# Altium schematic sheet VTG-Ctrl.SchDoc
size A4; Author: Auth. Name; CompanyName: Audi Formula Racing GmbH; Organization: Audi Formula Racing GmbH; Address1: Heinrichsheimstr. 200; Address2: D-86633 Neuburg a.d. Donau; SheetNumber: 1; SheetTotal: 14
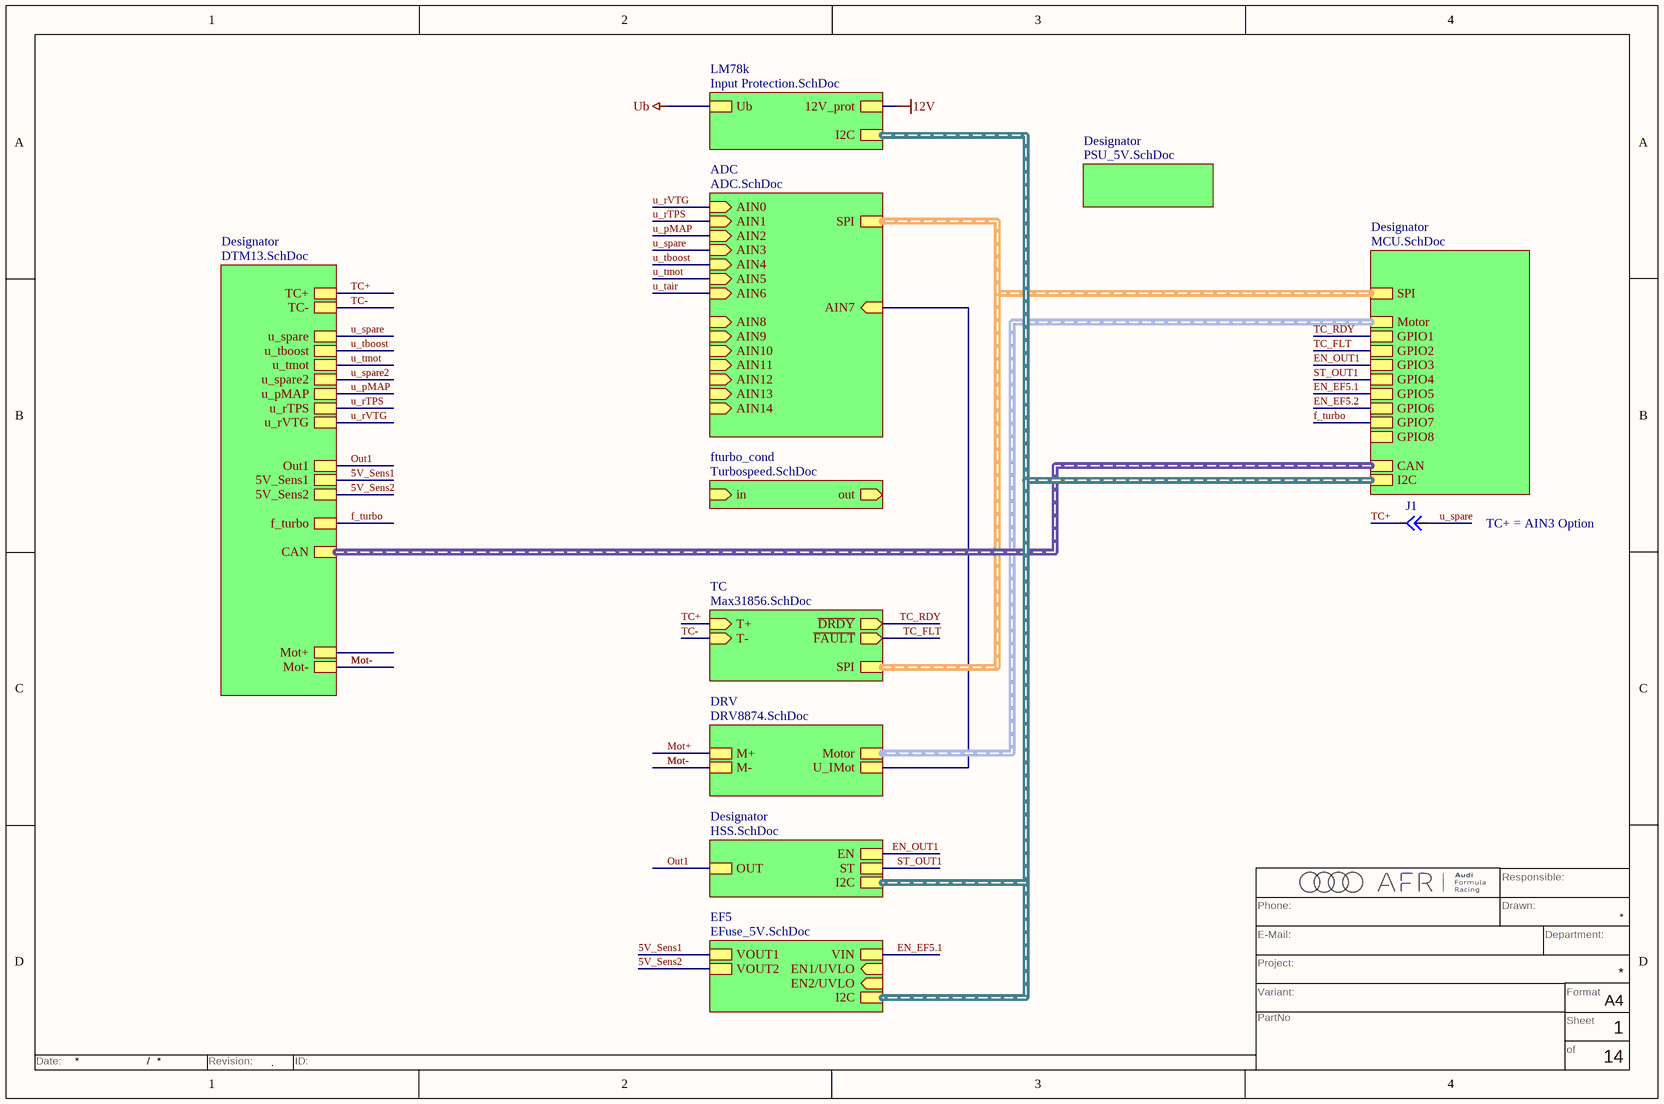
[diagram p0: VTG-Ctrl.SchDoc]

## Parts
J1  JUMPER  [JUMPER]  (value not drawn)

## Sub-sheets
ADC = ADC.SchDoc: AIN0 (in), AIN1 (in), AIN2 (in), AIN3 (in), AIN4 (in), AIN5 (in), AIN6 (in), AIN7 (in), SPI (harness SPI), AIN8 (in), AIN9 (in), AIN10 (in), AIN11 (in), AIN12 (in), AIN13 (in), AIN14 (in)
Designator = MCU.SchDoc: SPI (harness SPI), Motor (harness MotCtrl), GPIO1, GPIO2, GPIO3, GPIO4, GPIO5, CAN (harness CAN), GPIO6, GPIO7, GPIO8, I2C (harness I2C)
Designator = PSU_5V.SchDoc: no entries
Designator = HSS.SchDoc: ST, EN, OUT, I2C (harness I2C)
Designator = DTM13.SchDoc: TC+, TC-, u_spare, u_tboost, u_tmot, u_spare2, Out1, u_pMAP, u_rTPS, 5V_Sens1, 5V_Sens2, f_turbo, u_rVTG, Mot+, Mot-, CAN (harness CAN)
DRV = DRV8874.SchDoc: Motor (harness MotCtrl), U_IMot, M+, M-
EF5 = EFuse_5V.SchDoc: VIN, VOUT1, EN1/UVLO (in), EN2/UVLO (in), VOUT2, I2C (harness I2C)
fturbo_cond = Turbospeed.SchDoc: in (in), out (out)
LM78k = Input Protection.SchDoc: Ub, 12V_prot, I2C (harness I2C)
TC = Max31856.SchDoc: T- (in), T+ (in), ~{DRDY} (out), ~{FAULT} (out), SPI (harness SPI)

## Nets
12V: sheet LM78k/12V_prot
Ub: sheet LM78k/Ub
5V_Sens1: sheet EF5/VOUT1, sheet Designator/5V_Sens1
5V_Sens2: sheet EF5/VOUT2, sheet Designator/5V_Sens2
EN_EF5.1: sheet Designator/GPIO5, sheet EF5/VIN
EN_EF5.2: sheet Designator/GPIO6
EN_OUT1: sheet Designator/GPIO3, sheet Designator/EN
f_turbo: sheet Designator/GPIO7, sheet Designator/f_turbo
Mot+: sheet DRV/M+
Mot-: sheet DRV/M-, sheet Designator/Mot-
Out1: sheet Designator/OUT, sheet Designator/Out1
ST_OUT1: sheet Designator/GPIO4, sheet Designator/ST
TC+: J1.1 ; sheet TC/T+, sheet Designator/TC+
TC-: sheet TC/T-, sheet Designator/TC-
TC_FLT: sheet Designator/GPIO2, sheet TC/~{FAULT}
TC_RDY: sheet Designator/GPIO1, sheet TC/~{DRDY}
u_pMAP: sheet ADC/AIN2, sheet Designator/u_pMAP
u_rTPS: sheet ADC/AIN1, sheet Designator/u_rTPS
u_rVTG: sheet ADC/AIN0, sheet Designator/u_rVTG
u_spare: J1.2 ; sheet ADC/AIN3, sheet Designator/u_spare
u_spare2: sheet Designator/u_spare2
u_tair: sheet ADC/AIN6
u_tboost: sheet ADC/AIN4, sheet Designator/u_tboost
u_tmot: sheet ADC/AIN5, sheet Designator/u_tmot
(unnamed): sheet DRV/U_IMot, sheet ADC/AIN7

## Buses and harness runs
harness sheet ADC/SPI = sheet Designator/SPI = sheet TC/SPI
harness sheet Designator/I2C = sheet EF5/I2C = sheet LM78k/I2C
harness sheet Designator/Motor = sheet DRV/Motor

## Notes on the sheet
- TC+ = AIN3 Option
- Phone:
- Responsible:
- Drawn:
- Variant:
- Project:
- E-Mail:
- Department:
- Format
- PartNo
- of
- Sheet
- A4
- Date:
- /
- Revision:
- .
- ID:

## Library data of the parts
J1 = CMP-009-00061-4: Pins: 2